# Altium schematic sheet USB.SchDoc
size A4
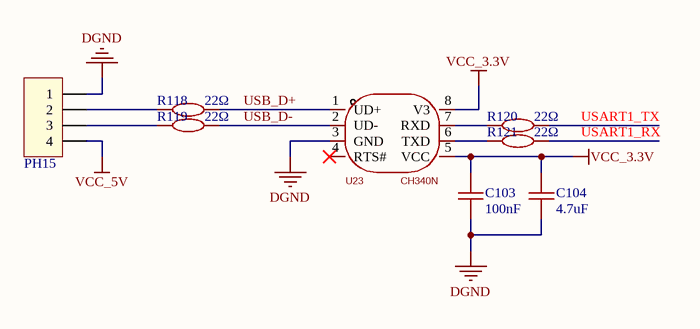
[diagram p0: USB.SchDoc]

## Parts
C103  100nF  [C0603]
C104  4.7uF  [C0603]
PH15  PH2.0-4P  [PH2.0-4P 弯针]  (value not drawn)
R118  22Ω  [R0603]
R119  22Ω  [R0603]
R120  22Ω  [R0603]
R121  22Ω  [R0603]
U23  CH340N  [SOP-8_L4.9-W3.9-P1.27-LS6.0-BL]

## Nets
DGND: C103.1 C104.1 PH15.1 U23.3(GND)
VCC_3.3V: C103.2 C104.2 U23.5(VCC) U23.8(V3)
VCC_5V: PH15.4
USART1_RX: R121.2
USART1_TX: R120.2
USB_D+: R118.2 U23.1(UD+)
USB_D-: R119.2 U23.2(UD-)
NetPH15_2: PH15.2 R118.1
NetPH15_3: PH15.3 R119.1
NetR120_1: R120.1 U23.7(RXD)
NetR121_1: R121.1 U23.6(TXD)

Not connected (* = marked no-connect by the designer): U23 4(RTS#)*

## Library data of the parts
C103 = 100nF/50V,C0603: 贴片电容,X7R; ComponentLink1Description: 供应商链接; ComponentLink1URL: http://www.szlcsc.com/product/details_16531.html
C104 = 4.7uF/50V,C0603: 贴片电容,X7R; ComponentLink1Description: 供应商链接; ComponentLink1URL: http://www.szlcsc.com/product/details_16531.html
R118-R121 = 22Ω,R0603: 电阻类型:厚膜电阻;阻值:22Ω;精度:±1%;功率:100mW;最大工作电压:75V;温度系数:±100ppm/℃;
U23 = CH340N: Manufacturer: WCH(南京沁恒); Symbol: CH340N_C2977777; Add into BOM: yes; Applications Function: USB转串口; Protocol: USB 2.0; Number of Channels: 1; Voltage - Supply: 3.3V；5V; Data Rate: 2Mbps; Device: CH340N; LCSC Part Name: USB2.0芯片CH340; Supplier Part: C2977777; Manufacturer Part: CH340N; Supplier Footprint: SOP-8; JLCPCB Part Class: Extended Part; Datasheet: https://atta.szlcsc.com/upload/public/pdf/source/20240313/115CDE92081B1D6CB446704AD5D0F5F2.pdf; Supplier: LCSC; Convert to PCB: yes; Operating Temperature: -20℃~+70℃